# Altium schematic sheet 04.  SoC EVM PMIC PDN-0.6.SchDoc: SoC EVM PMIC PDN-0.6
size 513 x 386 mm; Project: PROC154E2(001)_SK_AM69; Issue: 1.0; RevCode: E3; Page Create Date: March  8, 1995; Variant Name: Core Design; Schematic Page Number: 4; Page Number: 4; Page Size: C; Comment: MISTRAL_TITLEBLK_CSIZE_1; Page Count: 62; Schematic Page Count: 62; Name: PROC154E2 001 SK AM69; DsnPath: C:\Users\danie\Downloads\sprr466c\PROC154E3_RP\PROC154E3_SCH.DSN; SchematicName: SCHEMATIC1; PageName: 04.  SoC EVM PMIC PDN-0.6; PageSize: C; TopSchematic: True
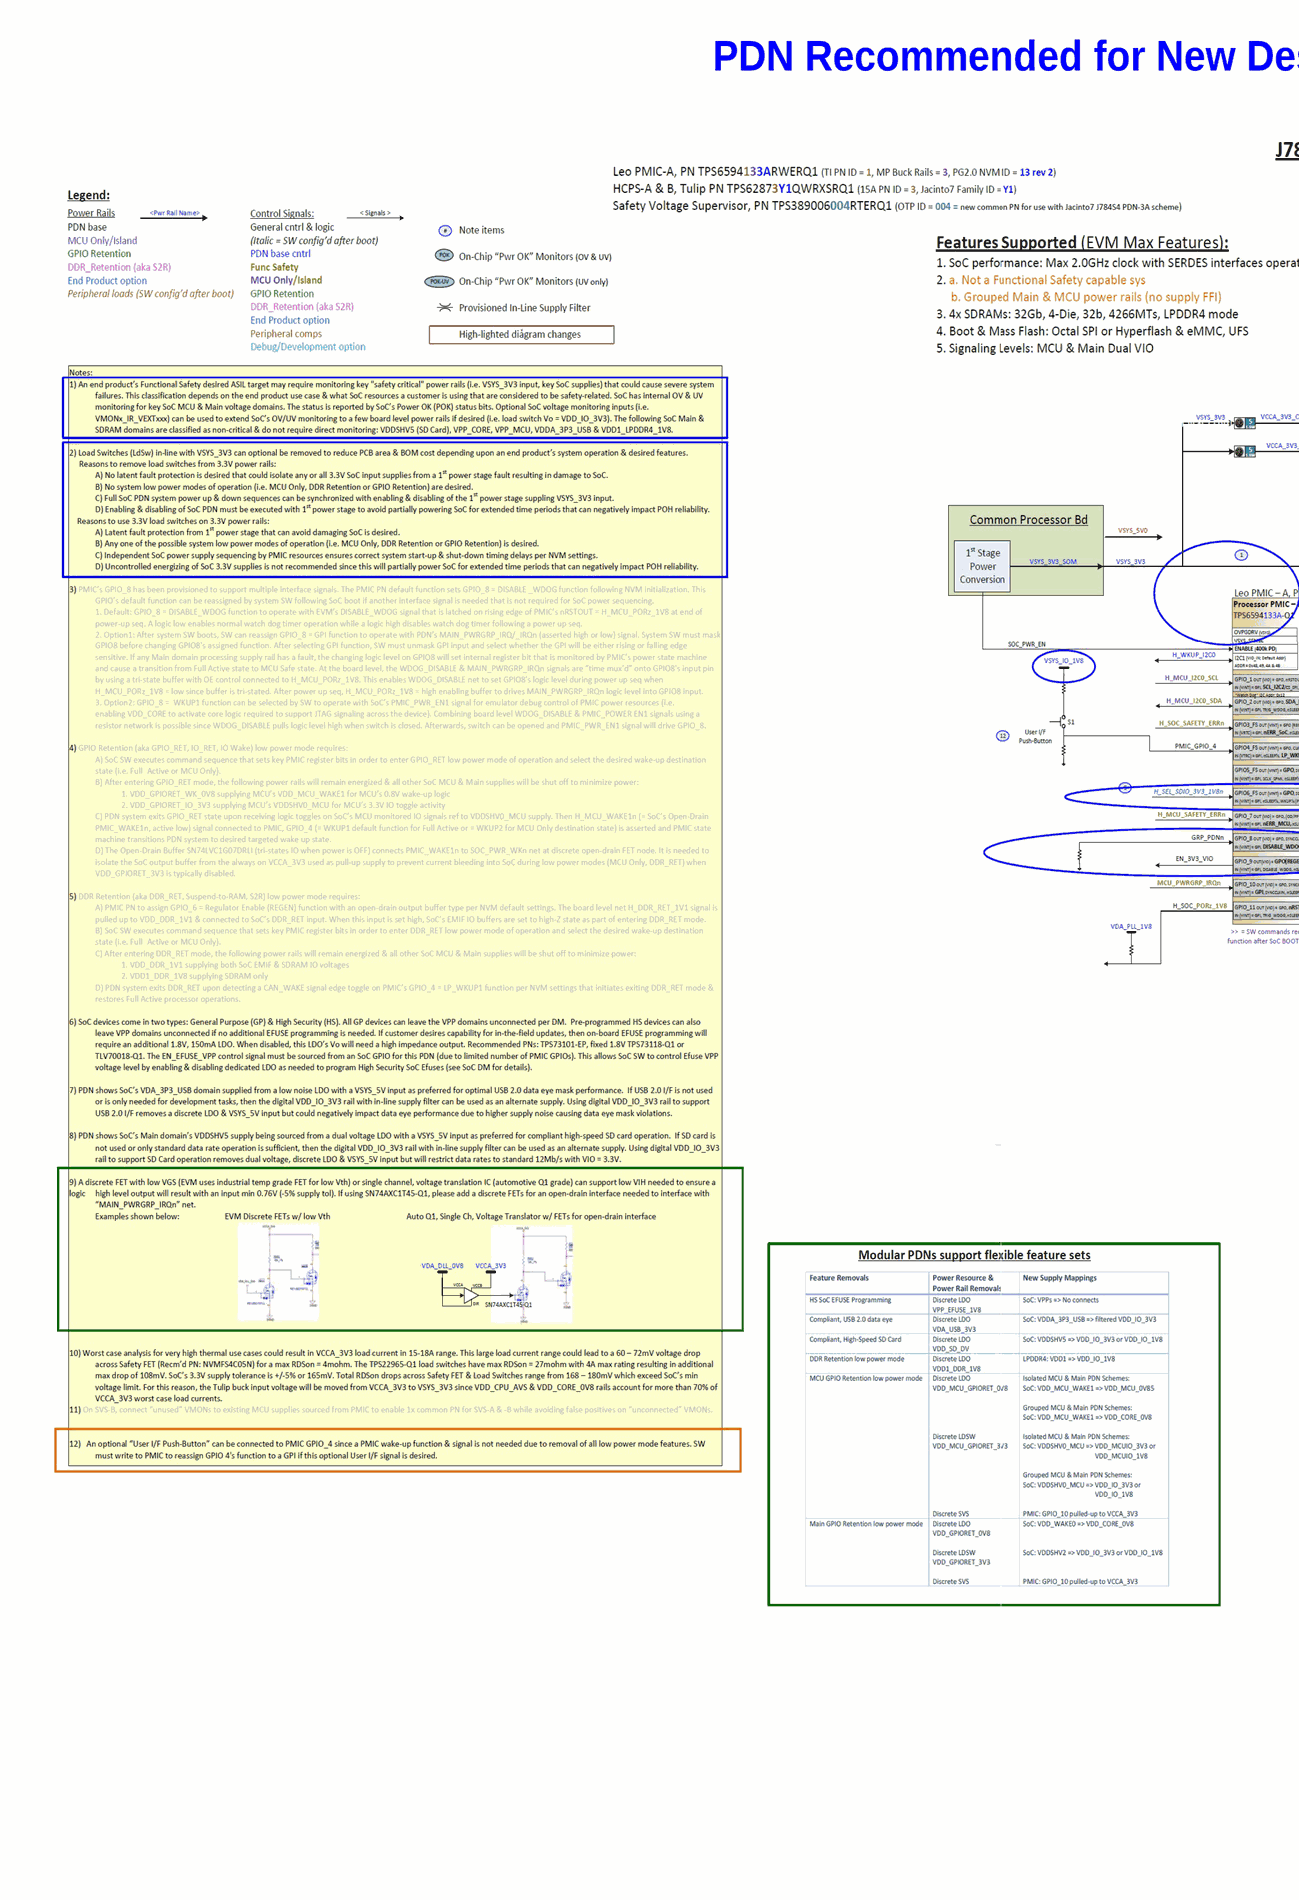
[diagram p0: 04.  SoC EVM PMIC PDN-0.6.SchDoc, left]
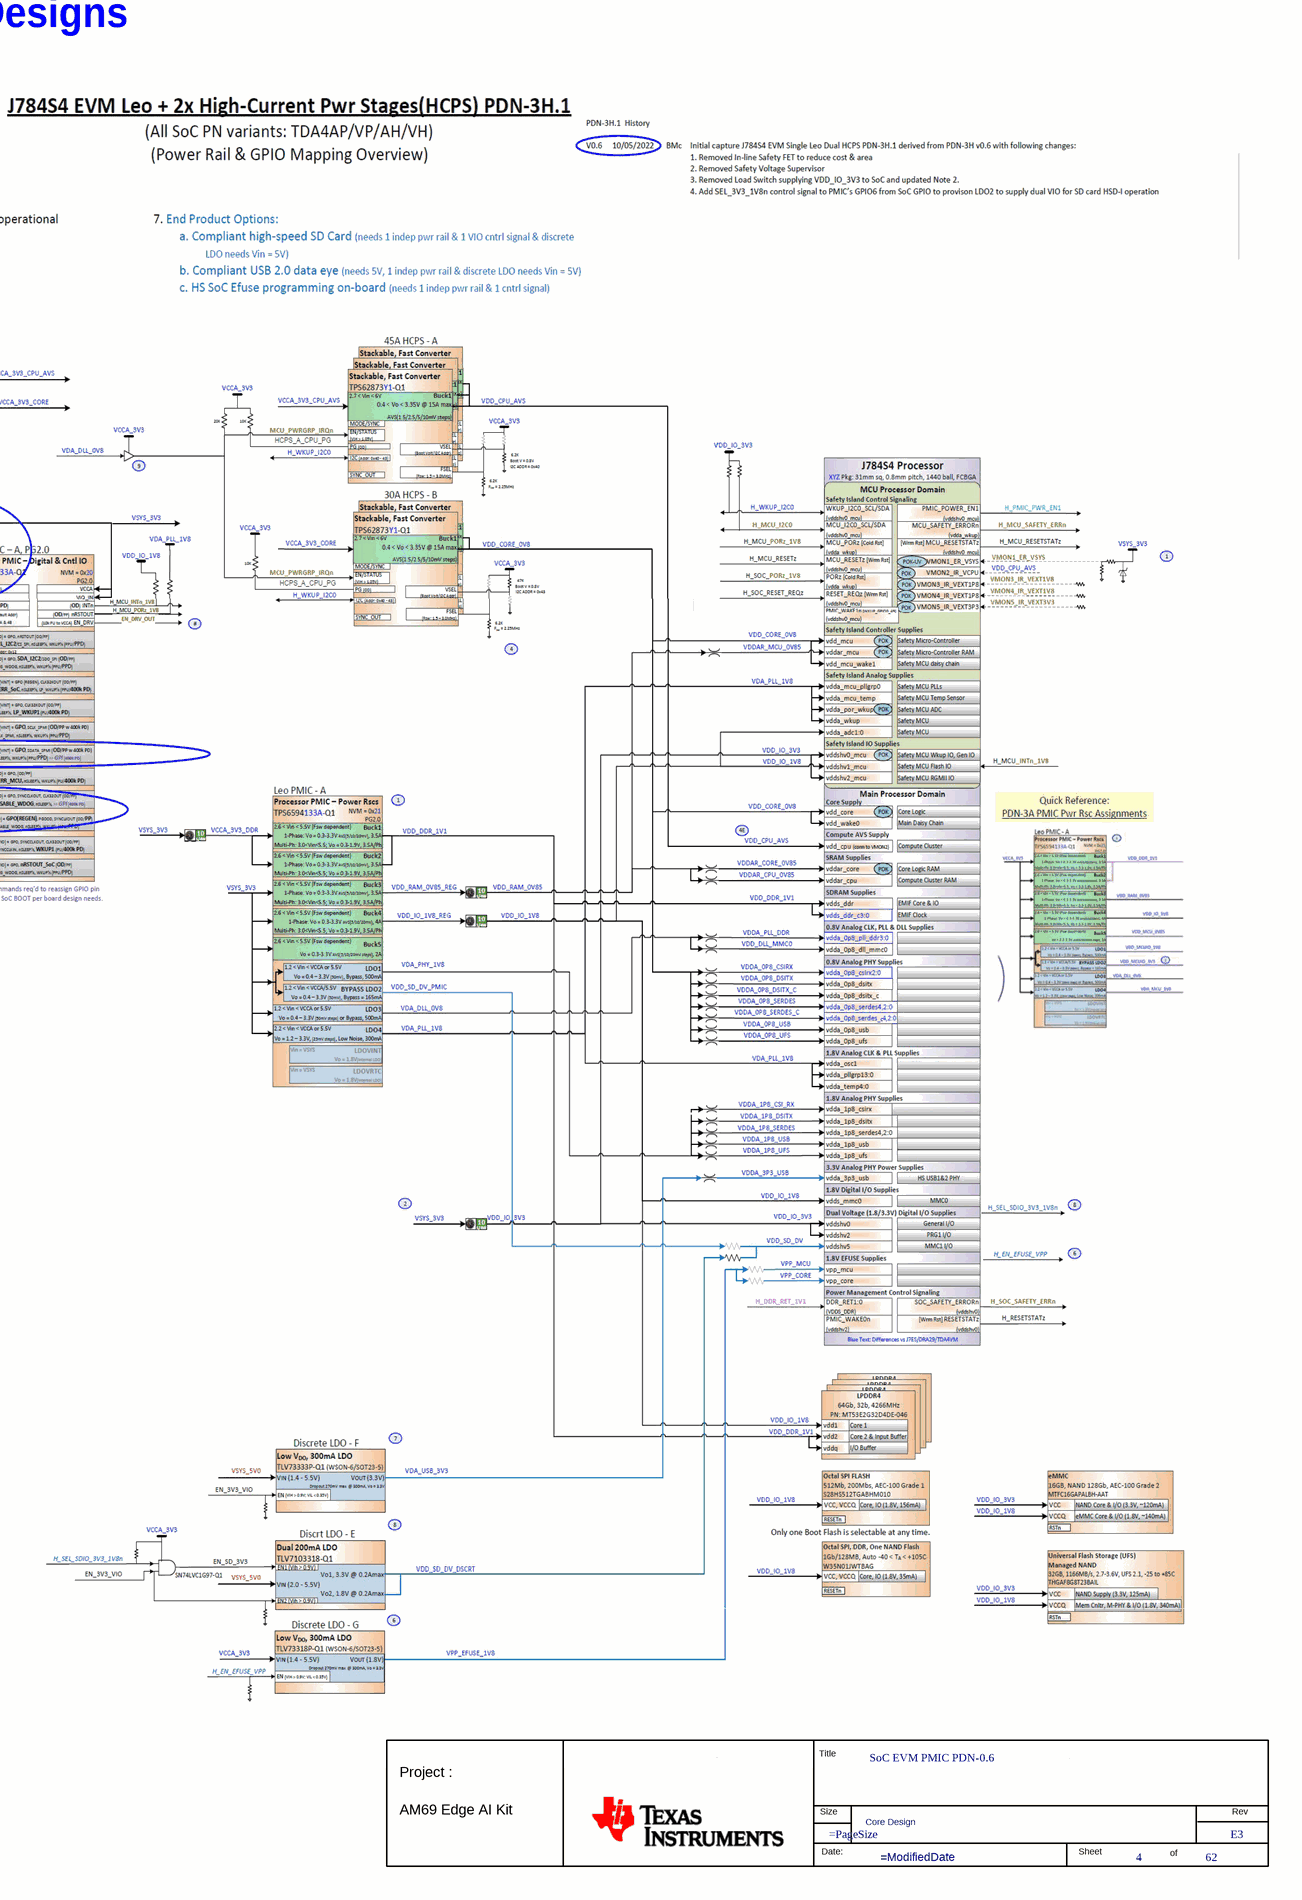
[diagram p1: 04.  SoC EVM PMIC PDN-0.6.SchDoc, right]

## Parts
*  RevCode: E3  Title: SoC EVM PMIC PDN-0.6  Page Number: 4  Page Count: 62  Variant Name: Core Design  (hidden comment: MISTRAL_TITLEBLK_CSIZE_1)  (graphical)

## Notes on the sheet
- PDN Recommended for New Designs
- (in symbol MISTRAL_TITLEBLK_CSIZE_1) Title; Project :; Size; Rev; AM69 Edge AI Kit; Date:; Sheet; of

## Library data of the parts
* = MISTRAL_TITLEBLK_CSIZE_1: Issue: 1.0; Project: PROC154E2(001)_SK_AM69; Name: PROC154E2 001 SK AM69; Page Create Date: March  8, 1995; Page Size: =PageSize; Page Modify Date: =ModifiedDate; Schematic Page Count: 62; Schematic Page Number: 4